# Altium schematic sheet IPMC_MACP.SchDoc: IPMC Driver
size A2; DrawnBy: YYH; Revision: 1.0; PageSetup: Record=PageOptions|CenterHorizontal=True|CenterVertical=True|PrintScale=0.52|XCorrection=1.00|YCorrection=1.00|PrintKind=0|BorderSize=5000000|LeftOffset=0|BottomOffset=0|Orientation=2|PaperLength=1000|PaperWidth=1000|Scale=100|PaperSource=7|PrintQuality=-3|MediaType=1|DitherType=10|PrintScaleMode=1|PaperKind=A4 210 x 297 毫米¦PaperIndex=9
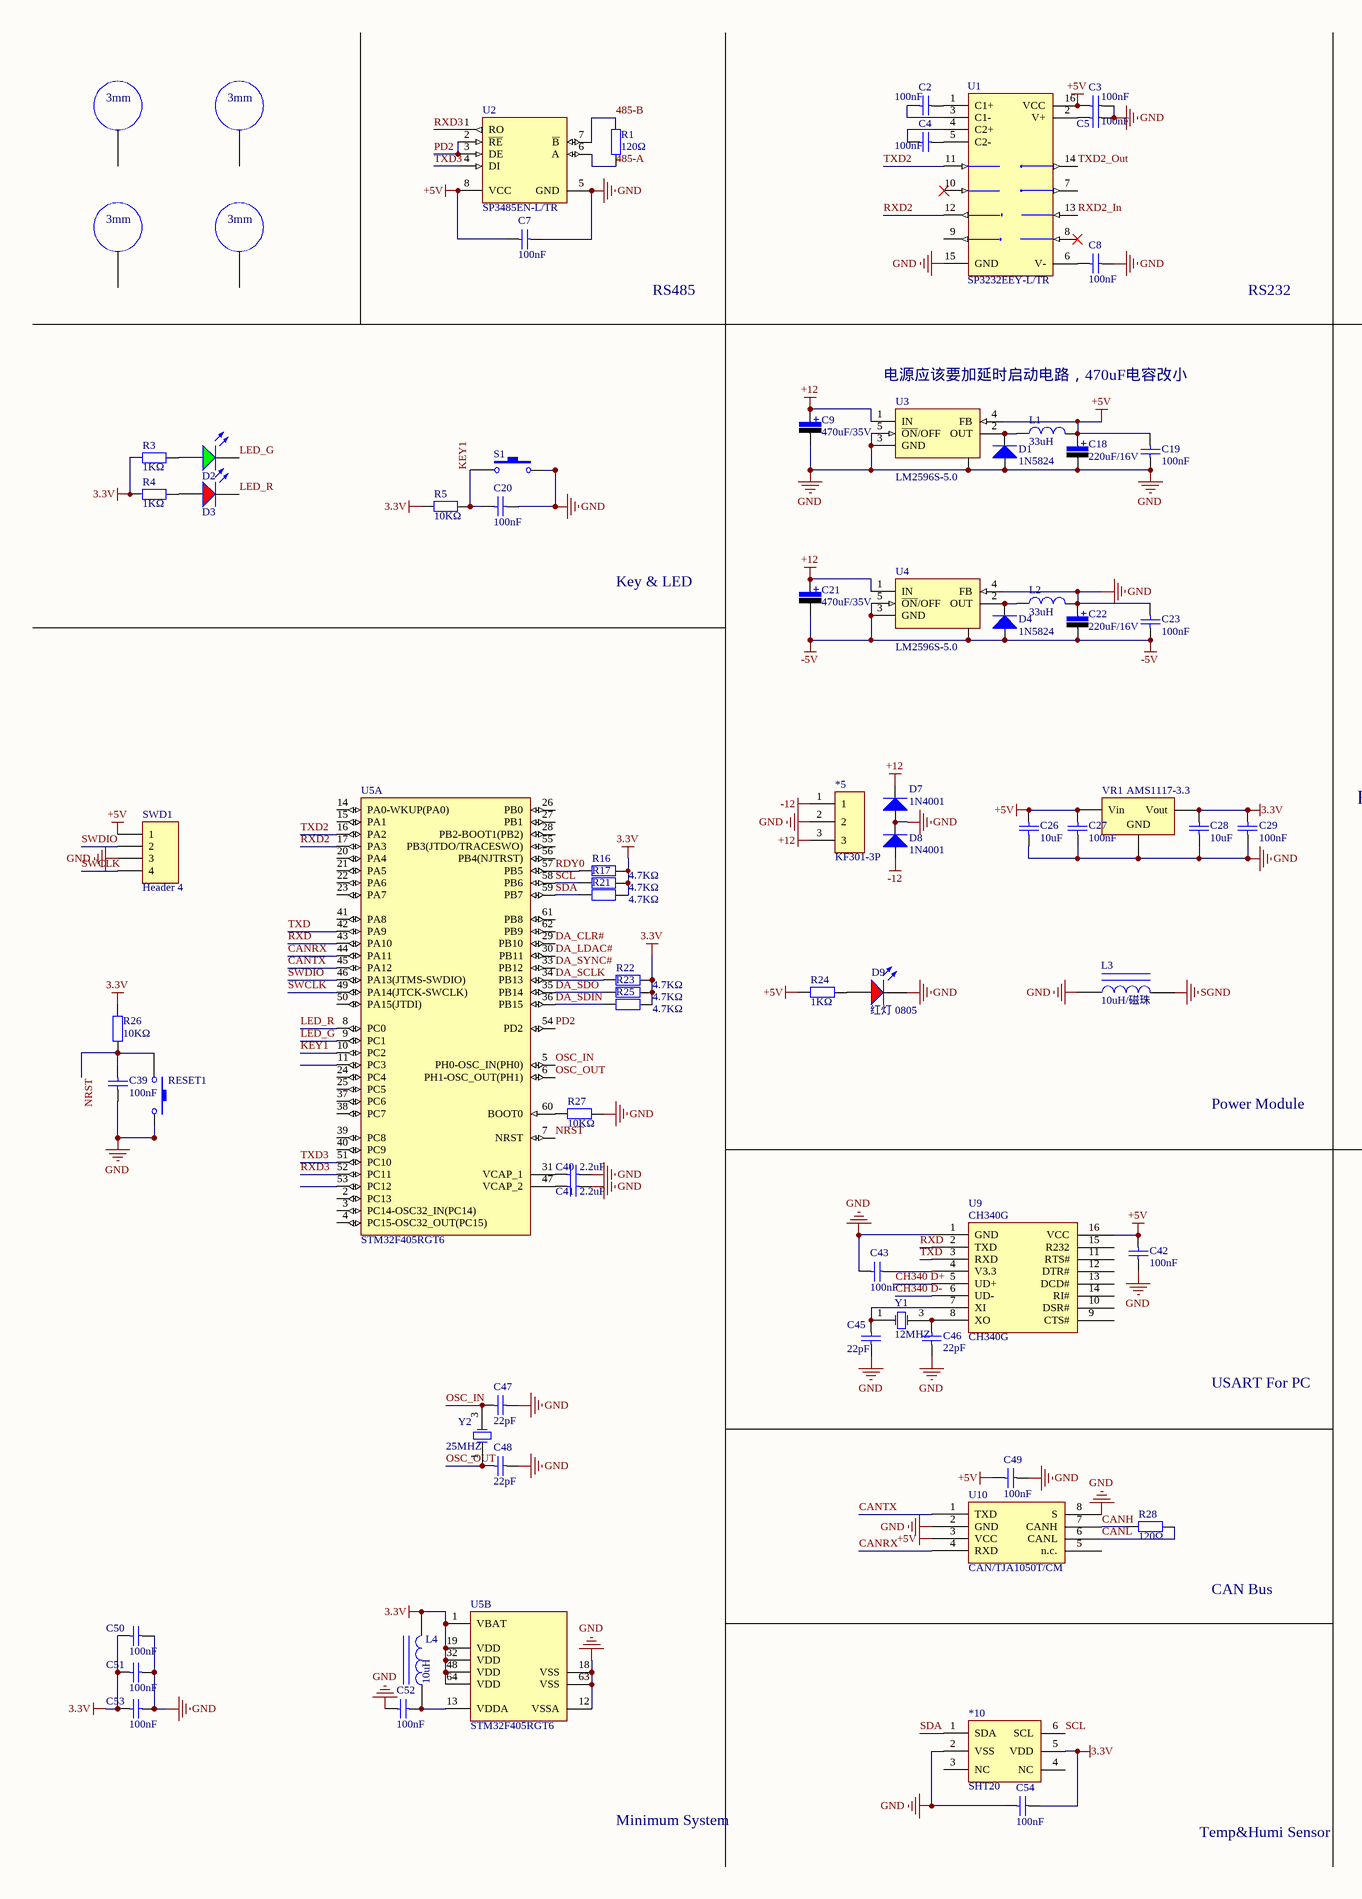
[diagram p0: IPMC_MACP.SchDoc, left]
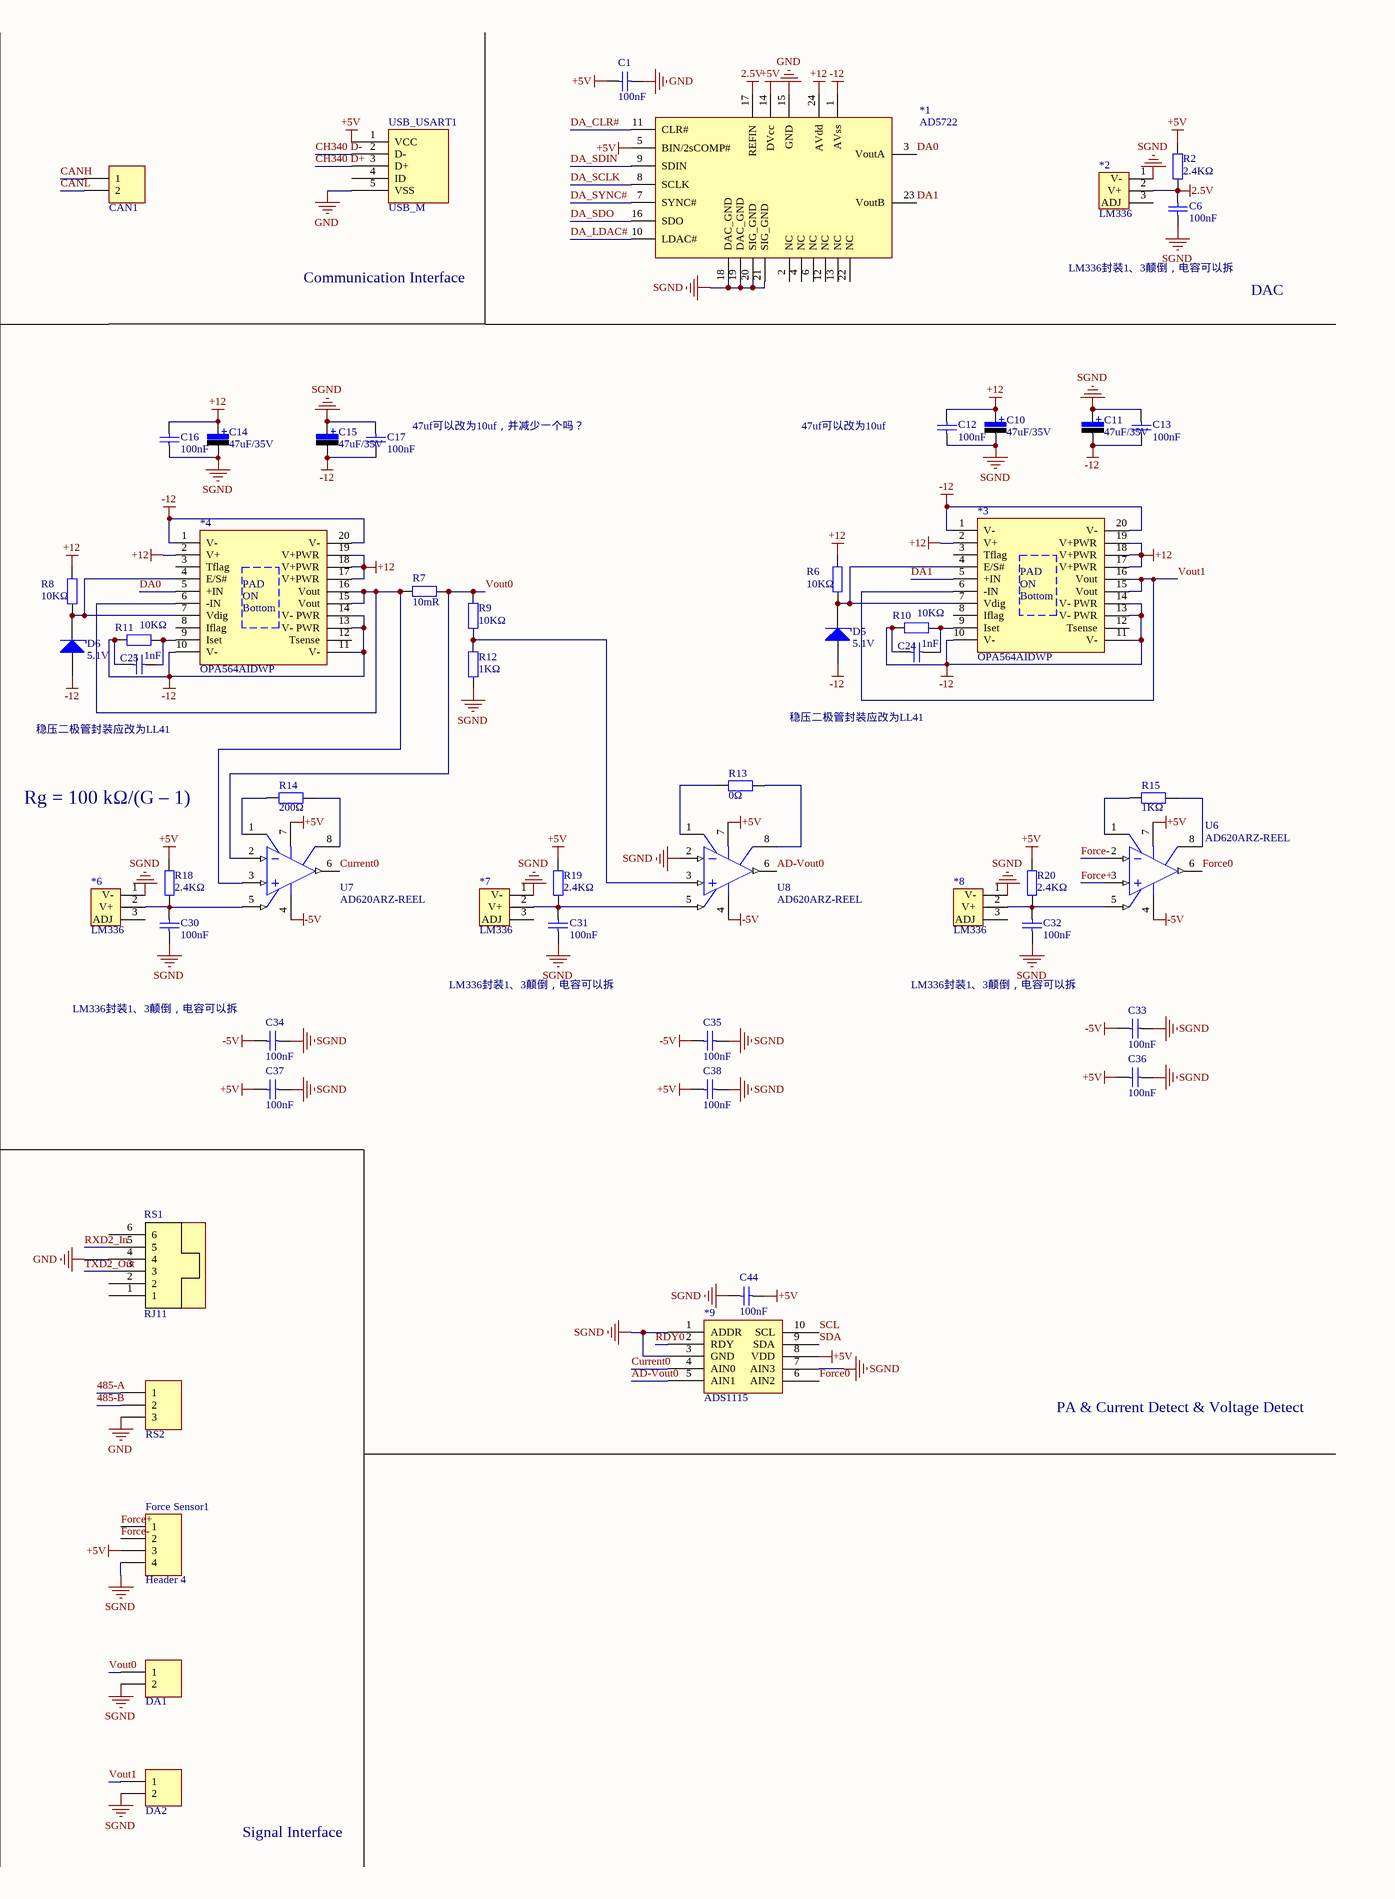
[diagram p1: IPMC_MACP.SchDoc, right]

## Parts
*1  AD5722  [TSSOP24P]
*2  LM336  [TO-92A]
*3  OPA564AIDWP  [HSOP20]
*4  OPA564AIDWP  [HSOP20]
*5  KF301-3P  [KF301-3P]
*6  LM336  [TO-92A]
*7  LM336  [TO-92A]
*8  LM336  [TO-92A]
*9  ADS1115  [MSOP-UN10_N]
*10  SHT20  [DFN6]
C1  100nF  [0805_C]
C2  100nF  [0805_C]
C3  100nF  [0805_C]
C4  100nF  [0805_C]
C5  100nF  [0805_C]
C6  100nF  [0805_C]
C7  100nF  [0805_C]
C8  100nF  [0805_C]
C9  470uF/35V  [C-RB-S10]
C10  47uF/35V  [C-RB-S6]
C11  47uF/35V  [C-RB-S6]
C12  100nF  [0805_C]
C13  100nF  [0805_C]
C14  47uF/35V  [C-RB-S6]
C15  47uF/35V  [C-RB-S6]
C16  100nF  [0805_C]
C17  100nF  [0805_C]
C18  220uF/16V  [C-RB-S6]
C19  100nF  [0805_C]
C20  100nF  [0805_C]
C21  470uF/35V  [C-RB-S10]
C22  220uF/16V  [C-RB-S6]
C23  100nF  [0805_C]
C24  1nF  [0805_C]
C25  1nF  [0805_C]
C26  10uF  [0805_C]
C27  100nF  [0805_C]
C28  10uF  [0805_C]
C29  100nF  [0805_C]
C30  100nF  [0805_C]
C31  100nF  [0805_C]
C32  100nF  [0805_C]
C33  100nF  [0805_C]
C34  100nF  [0805_C]
C35  100nF  [0805_C]
C36  100nF  [0805_C]
C37  100nF  [0805_C]
C38  100nF  [0805_C]
C39  100nF  [0805_C]
C40  2.2uF  [0805_C]
C41  2.2uF  [0805_C]
C42  100nF  [0805_C]
C43  100nF  [0805_C]
C44  100nF  [0805_C]
C45  22pF  [0805_C]
C46  22pF  [0805_C]
C47  22pF  [0805_C]
C48  22pF  [0805_C]
C49  100nF  [0805_C]
C50  100nF  [0805_C]
C51  100nF  [0805_C]
C52  100nF  [0805_C]
C53  100nF  [0805_C]
C54  100nF  [0805_C]
CAN1  Header 2  [HDR2X1_B1]  (value not drawn)
D1  1N5824  [DIODE-SMA]
D2  翠绿 0805  [0805_LED_S1]  (value not drawn)
D3  红灯 0805  [0805_LED_S1]  (value not drawn)
D4  1N5824  [DIODE-SMA]
D5  5.1V  [DIODE-1206]
D6  5.1V  [DIODE-1206]
D7  1N4001  [DIODE-SMA]
D8  1N4001  [DIODE-SMA]
D9  红灯 0805  [0805_LED_S1]
DA1  Header 2  [HDR2X1_B1]  (value not drawn)
DA2  Header 2  [HDR2X1_B1]  (value not drawn)
Force_Sensor1  Header 4  [HDR4X1_B1]
L1  33uH  [L-SMD-12]
L2  33uH  [L-SMD-12]
L3  10uH/磁珠  [0805_L]
L4  10uH  [0805_L]
R1  120Ω  [0805_R]
R2  2.4KΩ  [0805_R]
R3  1KΩ  [0805_R]
R4  1KΩ  [0805_R]
R5  10KΩ  [0805_R]
R6  10KΩ  [0805_R]
R7  10mR  [2512]
R8  10KΩ  [0805_R]
R9  10KΩ  [0805_R]
R10  10KΩ  [0805_R]
R11  10KΩ  [0805_R]
R12  1KΩ  [0805_R]
R13  0Ω  [0805_R]
R14  200Ω  [0805_R]
R15  1KΩ  [0805_R]
R16  4.7KΩ  [0805_R]
R17  4.7KΩ  [0805_R]
R18  2.4KΩ  [0805_R]
R19  2.4KΩ  [0805_R]
R20  2.4KΩ  [0805_R]
R21  4.7KΩ  [0805_R]
R22  4.7KΩ  [0805_R]
R23  4.7KΩ  [0805_R]
R24  1KΩ  [0805_R]
R25  4.7KΩ  [0805_R]
R26  10KΩ  [0805_R]
R27  10KΩ  [0805_R]
R28  120Ω  [0805_R]
RESET1  SW-PB  [SW_PB2_A1]  (value not drawn)
RS1  RJ11  [RJ6-RJ11]
RS2  Header 3  [HDR3X1_B1]  (value not drawn)
S1  SW-PB  [SW_PB2_A1]  (value not drawn)
SWD1  Header 4  [HDR1X4]
T1  M3铜柱螺丝孔  [螺丝孔-3mm]  (value not drawn)
T2  M3铜柱螺丝孔  [螺丝孔-3mm]  (value not drawn)
T3  M3铜柱螺丝孔  [螺丝孔-3mm]  (value not drawn)
T4  M3铜柱螺丝孔  [螺丝孔-3mm]  (value not drawn)
U1  SP3232EEY-L/TR  [TSSOP-16]
U2  SP3485EN-L/TR  [SOIC-8_150mil]
U3  LM2596S-5.0  [TO-263-5]
U4  LM2596S-5.0  [TO-263-5]
U5  STM32F405RGT6  [STM-LQFP64_L]  (parts A,B of 2)
U6  AD620ARZ-REEL  [SOIC-8_150mil]
U7  AD620ARZ-REEL  [SOIC-8_150mil]
U8  AD620ARZ-REEL  [SOIC-8_150mil]
U9  CH340G  [SOIC-16_150mil]
U10  CAN/TJA1050T/CM  [SOIC-8_150mil]
USB_USART1  USB_M  [USB_MICRO]
VR1  AMS1117-3.3  [SOT-223]
Y1  12MHZ  [SMD-3225_4P]
Y2  25MHZ  [SMD-3225_4P]

## Nets
2.5V: *1.17(REFIN) *2.2(V+) C6.2 R2.1
3.3V: *10.5(VDD) C28.2 C29.2 C50.1 C51.1 C53.1 C54.1 L4.2 R3.1 R4.1 R5.1 R16.2 R17.2 R21.2 R22.2 R23.2 R25.2 R26.1 U5.1(VBAT) U5.19(VDD) U5.32(VDD) U5.48(VDD) U5.64(VDD) VR1.2(Vout)
+5V: *1.5(BIN/2sCOMP#) *1.14(DVcc) *9.8(VDD) C1.2 C3.1 C7.2 C18.1 C19.2 C26.2 C27.2 C36.2 C37.2 C38.2 C42.2 C44.1 C49.2 Force_Sensor1.3 L1.2 R2.2 R18.2 R19.2 R20.2 R24.1 SWD1.1 U1.16(VCC) U2.8(VCC) U3.4(FB) U6.7(V+) U7.7(V+) U8.7(V+) U9.16(VCC) U10.3(VCC) USB_USART1.1(VCC) VR1.3(Vin)
+12: *1.24(AVdd) *3.2(V+) *3.17(V+PWR) *3.18(V+PWR) *3.19(V+PWR) *4.2(V+) *4.17(V+PWR) *4.18(V+PWR) *4.19(V+PWR) *5.3 C9.1 C10.1 C12.2 C14.1 C16.2 C21.1 D7.2(K) R6.2 R8.2 U3.1(IN) U4.1(IN)
-5V: C21.2 C22.2 C23.1 C33.2 C34.2 C35.2 D4.1(A) U4.3(GND) U4.5(~{ON}/OFF) U4.6 U6.4(V-) U7.4(V-) U8.4(V-)
-12: *1.1(AVss) *3.1(V-) *3.10(V-) *3.11(V-) *3.13(V-_PWR) *3.14(V-_PWR) *3.20(V-) *4.1(V-) *4.10(V-) *4.11(V-) *4.13(V-_PWR) *4.14(V-_PWR) *4.20(V-) *5.1 C11.2 C13.2 C15.2 C17.2 C24.1 C25.1 D5.1(A) D6.1(A) D8.1(A) R10.1 R11.1
GND: *1.15(GND) *5.2 *10.2(VSS) C1.1 C3.2 C5.2 C7.1 C8.2 C9.2 C18.2 C19.1 C20.2 C22.1 C23.2 C26.1 C27.1 C28.1 C29.1 C39.2 C40.2 C41.2 C42.1 C43.2 C45.1 C46.1 C47.1 C48.1 C49.1 C50.2 C51.2 C52.2 C53.2 C54.2 D1.1(A) D7.1(A) D8.2(K) D9.K L2.2 L3.1 R27.1 RESET1.2 RS1.4 RS2.3 S1.2 SWD1.3 U1.15(GND) U2.5(GND) U3.3(GND) U3.5(~{ON}/OFF) U3.6 U4.4(FB) U5.12(VSSA) U5.18(VSS) U5.63(VSS) U9.1(GND) U10.2(GND) U10.8(S) USB_USART1.5(VSS) VR1.1(GND)
SGND: *1.18(DAC_GND) *1.19(DAC_GND) *1.20(SIG_GND) *1.21(SIG_GND) *2.1(V-) *6.1(V-) *7.1(V-) *8.1(V-) *9.1(ADDR) *9.3(GND) *9.7(AIN3) C6.1 C10.2 C11.1 C12.1 C13.1 C14.2 C15.1 C16.1 C17.1 C30.1 C31.1 C32.1 C33.1 C34.1 C35.1 C36.1 C37.1 C38.1 C44.2 DA1.2 DA2.2 Force_Sensor1.4 L3.2 R12.2 U8.2(-IN)
485-A: R1.1 RS2.1 U2.6(A)
485-B: R1.2 RS2.2 U2.7(~{B})
AD-Vout0: *9.5(AIN1) U8.6(OUT)
CANH: CAN1.1 R28.1 U10.7(CANH)
CANL: CAN1.2 R28.2 U10.6(CANL)
CANRX: U5.44(PA11) U10.4(RXD)
CANTX: U5.45(PA12) U10.1(TXD)
CH340 D+: U9.5(UD+) USB_USART1.3(D+)
CH340 D-: U9.6(UD-) USB_USART1.2(D-)
Current0: *9.4(AIN0) U7.6(OUT)
DA0: *1.3(VoutA) *4.5(+IN)
DA1: *1.23(VoutB) *3.5(+IN)
DA_CLR#: *1.11(CLR#) U5.29(PB10)
DA_LDAC#: *1.10(LDAC#) U5.30(PB11)
DA_SCLK: *1.8(SCLK) R22.1 U5.34(PB13)
DA_SDIN: *1.9(SDIN) R25.1 U5.36(PB15)
DA_SDO: *1.16(SDO) R23.1 U5.35(PB14)
DA_SYNC#: *1.7(SYNC#) U5.33(PB12)
Force0: *9.6(AIN2) U6.6(OUT)
Force+: Force_Sensor1.1 U6.3(+IN)
Force-: Force_Sensor1.2 U6.2(-IN)
KEY1: C20.1 R5.2 S1.1 U5.10(PC2)
LED_G: D2.K U5.9(PC1)
LED_R: D3.K U5.8(PC0)
NRST: C39.1 R26.2 RESET1.1 U5.7(NRST)
OSC_IN: C47.2 U5.5(PH0-OSC_IN(PH0)) Y2.3(OSC2)
OSC_OUT: C48.2 U5.6(PH1-OSC_OUT(PH1)) Y2.1(OSC1)
PD2: U2.2(~{RE}) U2.3(DE) U5.54(PD2)
RDY0: *9.2(RDY) R16.1 U5.57(PB5)
RXD: U5.43(PA10) U9.2(TXD)
RXD2: U1.12(R1OUT) U5.17(PA3)
RXD2_In: RS1.5 U1.13(R1IN)
RXD3: U2.1(RO) U5.52(PC11)
SCL: *9.10(SCL) *10.6(SCL) R17.1 U5.58(PB6)
SDA: *9.9(SDA) *10.1(SDA) R21.1 U5.59(PB7)
SWCLK: SWD1.4 U5.49(PA14(JTCK-SWCLK))
SWDIO: SWD1.2 U5.46(PA13(JTMS-SWDIO))
TXD: U5.42(PA9) U9.3(RXD)
TXD2: U1.11(T1IN) U5.16(PA2)
TXD2_Out: RS1.3 U1.14(T1OUT)
TXD3: U2.4(DI) U5.51(PC10)
Vout0: DA1.1 R7.2 R9.1 U7.2(-IN)
Vout1: *3.6(-IN) *3.15(Vout) *3.16(Vout) DA2.1
Net*3_4: *3.4(E/S#) *3.7(Vdig) D5.2(K) R6.1
Net*3_9: *3.9(Iset) C24.2 R10.2
Net*4_4: *4.4(E/S#) *4.7(Vdig) D6.2(K) R8.1
Net*4_6: *4.6(-IN) *4.15(Vout) *4.16(Vout) R7.1 U7.3(+IN)
Net*4_9: *4.9(Iset) C25.2 R11.2
Net*6_2: *6.2(V+) C30.2 R18.1 U7.5(REF)
Net*7_2: *7.2(V+) C31.2 R19.1 U8.5(REF)
Net*8_2: *8.2(V+) C32.2 R20.1 U6.5(REF)
NetC2_1: C2.1 U1.3(C1-)
NetC2_2: C2.2 U1.1(C1+)
NetC4_1: C4.1 U1.4(C2+)
NetC4_2: C4.2 U1.5(C2-)
NetC5_1: C5.1 U1.2(V+)
NetC8_1: C8.1 U1.6(V-)
NetC40_1: C40.1 U5.31(VCAP_1)
NetC41_1: C41.1 U5.47(VCAP_2)
NetC43_1: C43.1 U9.4(V3.3)
NetC45_2: C45.2 U9.7(XI) Y1.1(OSC1)
NetC46_2: C46.2 U9.8(XO) Y1.3(OSC2)
NetC52_1: C52.1 L4.1 U5.13(VDDA)
NetD1_2: D1.2(K) L1.1 U3.2(OUT)
NetD2_A: D2.A R3.2
NetD3_A: D3.A R4.2
NetD4_2: D4.2(K) L2.1 U4.2(OUT)
NetD9_A: D9.A R24.2
NetR9_2: R9.2 R12.1 U8.3(+IN)
NetR13_1: R13.1 U8.1(RG)
NetR13_2: R13.2 U8.8(RG)
NetR14_1: R14.1 U7.1(RG)
NetR14_2: R14.2 U7.8(RG)
NetR15_1: R15.1 U6.1(RG)
NetR15_2: R15.2 U6.8(RG)
NetR27_2: R27.2 U5.60(BOOT0)

Not connected (* = marked no-connect by the designer): *1 2(NC) 4(NC) 6(NC) 12(NC) 13(NC) 22(NC); *2 3(ADJ); *3 3(Tflag) 8(Iflag) 12(Tsense); *4 3(Tflag) 8(Iflag) 12(Tsense); *6 3(ADJ); *7 3(ADJ); *8 3(ADJ); *10 3(NC) 4(NC); RS1 1 2 6; T1 1; T2 1; T3 1; T4 1; U1 7(T2OUT) 8(R2IN)* 9(R2OUT) 10(T2IN)*; U5 2(PC13) 3(PC14-OSC32_IN(PC14)) 4(PC15-OSC32_OUT(PC15)) 11(PC3) 14(PA0-WKUP(PA0)) 15(PA1) 20(PA4) 21(PA5) 22(PA6) 23(PA7) 24(PC4) 25(PC5) 26(PB0) 27(PB1) 28(PB2-BOOT1(PB2)) 37(PC6) 38(PC7) 39(PC8) 40(PC9) 41(PA8) 50(PA15(JTDI)) 53(PC12) 55(PB3(JTDO/TRACESWO)) 56(PB4(NJTRST)) 61(PB8) 62(PB9); U9 9(CTS#) 10(DSR#) 11(RTS#) 12(DTR#) 13(DCD#) 14(RI#) 15(R232); U10 5(n.c.); USB_USART1 4(ID)

## Notes on the sheet
- Communication Interface
- LM336封装1、3颠倒，电容可以拆
- RS485
- RS232
- DAC
- 电源应该要加延时启动电路，470uF电容改小
- (near C17) 47uf可以改为10uf，并减少一个吗？
- 47uf可以改为10uf
- Key & LED
- 稳压二极管封装应改为LL41
- Rg = 100 kΩ/(G – 1)
- Power Module
- USART For PC
- PA & Current Detect & Voltage Detect
- CAN Bus
- Minimum System
- Temp&Humi Sensor
- Signal Interface
- (in symbol M3铜柱螺丝孔) 3mm
- (in symbol OPA564AIDWP) PAD; ON; Bottom

## Library data of the parts
*1 = AD5722: 双极性DAC
*2 *6-*8 = LM336: 基准电压芯片2.5/5V
*3 *4 = OPA564AIDWP: PAD on Bottom
*5 = KF301-3P: 蓝色端子
C1-C8 C12 C13 C16 C17 C19 C20 C23 C27 C29-C39 C42-C44 C49-C54 = 0805 100nF(104) 10% 50V: 贴片电容; ComponentLink1Description: 供应商链接; ComponentLink1URL: http://www.szlcsc.com/product/details_50686.html; Package: 0805; Supplier: LC; SuppliersPartNumber: C49678
C9-C11 C14 C15 C18 C21 C22 = Cap Pol: 极性电解电容; Published: 8-Jun-2000; LatestRevisionDate: 17-Jul-2002; LatestRevisionNote: Re-released for DXP Platform.; PackageReference: RB7.6-15; Publisher: Altium Limited
C24 C25 = 0805 1nF (102) 10% 50V: 贴片电容; ComponentLink1Description: 供应商链接; ComponentLink1URL: http://www.szlcsc.com/product/details_52223.html; Package: 0805; Supplier: LC; SuppliersPartNumber: C51210
C26 C28 = 0805 10uF (106) 10% 25V: 贴片电容; ComponentLink1Description: 供应商链接; ComponentLink1URL: http://www.szlcsc.com/product/details_16532.html; Package: 0805; Supplier: LC; SuppliersPartNumber: C15850
C40 C41 = 0805 2.2uF (225) 20% 50V: 贴片电容; ComponentLink1Description: 供应商链接; ComponentLink1URL: http://www.szlcsc.com/product/details_50225.html; Package: 0805; Supplier: LC; SuppliersPartNumber: C49217
C45-C48 = 0805 22pF (220) 5% 50V: 贴片电容; ComponentLink1Description: 供应商链接; ComponentLink1URL: http://www.szlcsc.com/product/details_2156.html; Package: 0805; Supplier: LC; SuppliersPartNumber: C1804
CAN1 DA1 DA2 = Header 2: 接插件; LatestRevisionDate: 17-Jul-2002; LatestRevisionNote: Re-released for DXP Platform.; Publisher: Altium Limited
D1 D4 D7 D8 = Diode: 二极管; Published: 8-Jun-2000; LatestRevisionDate: 17-Jul-2002; LatestRevisionNote: Re-released for DXP Platform.; PackageDocument: Sep-1996; PackageReference: SMC; Publisher: Altium Limited; Code_JEDEC: DO-214-AB
D2 = 0805 翠绿: 发光二极管; ComponentLink1Description: 供应商链接; ComponentLink1URL: http://www.szlcsc.com/product/details_2670.html; Package: 0805; Supplier: LC; SuppliersPartNumber: C2297
D3 D9 = 0805 红灯: 发光二极管; ComponentLink1Description: 供应商链接; ComponentLink1URL: http://www.szlcsc.com/product/details_2668.html; Package: 0805; Supplier: LC; SuppliersPartNumber: C2295
D5 D6 = Diode-Z: 稳压二极管; Published: 8-Jun-2000; LatestRevisionDate: 17-Jul-2002; LatestRevisionNote: Re-released for DXP Platform.; PackageReference: SMB; Publisher: Altium Limited; Code_JEDEC: DO-214-AA
Force_Sensor1 SWD1 = Header 4: Header, 4-Pin; LatestRevisionDate: 17-Jul-2002; LatestRevisionNote: Re-released for DXP Platform.; Publisher: Altium Limited
L1 L2 = Inductor: 电感; Code_IEC: 1005; Published: 8-Jun-2000; LatestRevisionDate: 17-Jul-2002; LatestRevisionNote: Re-released for DXP Platform.; PackageReference: 0402-A; Publisher: Altium Limited; Code_JEITA: 0402
L3 L4 = 0805 10uH 10%: 贴片电感; ComponentLink1Description: 供应商链接; ComponentLink1URL: http://www.szlcsc.com/product/details_1398.html; Package: 0805; Supplier: LC; SuppliersPartNumber: C1046
R1 R28 = 0805 120Ω (1200) 1%: 贴片电阻; ComponentLink1Description: 供应商链接; ComponentLink1URL: http://www.szlcsc.com/product/details_18125.html; Package: 0805; Supplier: LC; SuppliersPartNumber: C17437
R2 R18-R20 = 0805 2.4KΩ (2401) 1%: 贴片电阻; ComponentLink1Description: 供应商链接; ComponentLink1URL: http://www.szlcsc.com/product/details_18214.html; Package: 0805; Supplier: LC; SuppliersPartNumber: C17526
R3 R4 R15 R24 = 0805 1KΩ (1001) 1%: 贴片电阻; ComponentLink1Description: 供应商链接; ComponentLink1URL: http://www.szlcsc.com/product/details_18201.html; Package: 0805; Supplier: LC; SuppliersPartNumber: C17513
R5 R6 R8 R10 R11 R26 R27 = 0805 10KΩ (1002) 1%: 贴片电阻; ComponentLink1Description: 供应商链接; ComponentLink1URL: http://www.szlcsc.com/product/details_18102.html; Package: 0805; Supplier: LC; SuppliersPartNumber: C17414
R7 = Res1: 贴片电阻; Published: 8-Jun-2000; LatestRevisionDate: 17-Jul-2002; LatestRevisionNote: Re-released for DXP Platform.; PackageReference: AXIAL-0.4; Publisher: Altium Limited
R9 R12 = 0805 20KΩ (2002) 1%: 贴片电阻; ComponentLink1Description: 供应商链接; ComponentLink1URL: http://www.szlcsc.com/product/details_4735.html; Package: 0805; Supplier: LC; SuppliersPartNumber: C4328
R13 = 0805 0Ω (0R0) 1%: 贴片电阻; ComponentLink1Description: 供应商链接; ComponentLink1URL: http://www.szlcsc.com/product/details_18165.html; Package: 0805; Supplier: LC; SuppliersPartNumber: C17477
R14 = 0805 200Ω (2000) 1%: 贴片电阻; ComponentLink1Description: 供应商链接; ComponentLink1URL: http://www.szlcsc.com/product/details_18228.html; Package: 0805; Supplier: LC; SuppliersPartNumber: C17540
R16 R17 R21-R23 R25 = 0805 4.7KΩ (4701) 1%: 贴片电阻; ComponentLink1Description: 供应商链接; ComponentLink1URL: http://www.szlcsc.com/product/details_18361.html; Package: 0805; Supplier: LC; SuppliersPartNumber: C17673
RESET1 S1 = SW-PB: 微动开关; Published: 24-Mar-1999; LatestRevisionDate: 17-Jul-2002; LatestRevisionNote: Re-released for DXP Platform.; PackageReference: SPST-2; Publisher: Altium Limited
RS2 = Header 3: 接插件; LatestRevisionDate: 17-Jul-2002; LatestRevisionNote: Re-released for DXP Platform.; Publisher: Altium Limited
U1 = SP3232EEY-L/TR: RS232; ComponentLink1Description: 供应商链接; ComponentLink1URL: http://www.szlcsc.com/product/details_14131.html; Package: TSSOP-16; Supplier: LC; SuppliersPartNumber: C13482
U2 = SP3485EN-L/TR: RS-485/RS-422; ComponentLink1Description: 供应商链接; ComponentLink1URL: http://www.szlcsc.com/product/details_9482.html; Package: SOIC-8; Supplier: LC; SuppliersPartNumber: C8963
U3 U4 = LM2596S-5.0: 5V稳压芯片; Note: Tab is connected to GND; Published: 15-Apr-2002; DatasheetVersion: Dec-1997; PackageReference: TS5B; Publisher: Altium Limited; PackageDescription: D2-PAK; 5 Leads; Body 14.4 (inc. leads) x 10.4 mm (LxW max); ComponentLink1Description: Manufacturer Link; ComponentLink1URL: http://www.national.com/; ComponentLink2Description: Datasheet; ComponentLink2URL: http://www.national.com/ds.cgi/LM/LM2596.pdf; ComponentLink3Description: URL Link1; ComponentLink3URL: http://www.national.com/pf/LM/LM2596.html
U5 = STM32F405RGT6: ARM Cortex-M4 32-bit MCU+FPU, 210 DMIPS, 1024 kB Flash, 192 kB Internal RAM, 51 I/Os, 64-pin LQFP, -40 to 85 degC, Tray; Manufacturer: STMicroelectronics; D/A Converter: 2x12-bit; FLASH Size (Prog) (kB): 1024; I/Os (High Current): 51; Internal RAM Size (kB): 192; Operating Frequency(F) (Processor speed) (MHz): 168; Supply Voltage(Vcc) max (V): 3.6; Supply Voltage(Vcc) min (V): 1.8; DatasheetVersion: Rev. 4; PackageVersion: Rev. 4, 06/2013; PackageReference: LQFP64; PackageDescription: 64-Pin Low Profile Quad Flat Package, 10 x 10 mm Body, 0.5 mm Pitch; Supplier 1: Digi-Key; Supplier Part Number 1: 497-11767-ND; Supplier 2: Farnell; Supplier Part Number 2: 2064363; Supplier 3: Newark; Supplier Part Number 3: 73T2329; Supplier 4: Mouser; Supplier Part Number 4: 511-STM32F405RGT6; Core: ARM Cortex-M4; Packing: Tray; Mounting Technology: Surface Mount; PartNumber: STM32F405RGT6; ComponentLink1Description: Manufacturer URL; ComponentLink1URL: http://www.st.com/web/en/home.html; ComponentLink2Description: Datasheet; ComponentLink2URL: http://www.st.com/st-web-ui/static/active/en/resource/technical/document/datasheet/DM00037051.pdf; ComponentLink3Description: Package Specification; ComponentLink3URL: http://www.st.com/st-web-ui/static/active/en/resource/technical/document/datasheet/DM00037051.pdf
U6-U8 = AD620ARZ-REEL: 仪放; ComponentLink1Description: 供应商链接; ComponentLink1URL: http://www.szlcsc.com/product/details_10205.html; Package: SOIC-8_150mil; Supplier: LC; SuppliersPartNumber: C9675
U9 = CH340G: USB; ComponentLink1Description: 供应商链接; ComponentLink1URL: http://www.szlcsc.com/product/details_14927.html; Package: SOIC-16_150mil; Supplier: LC; SuppliersPartNumber: C14267
U10 = CAN/TJA1050T/CM: CAN; ComponentLink1Description: 供应商链接; ComponentLink1URL: http://www.szlcsc.com/product/details_7424.html; Package: SOIC-8_150mil; Supplier: LC; SuppliersPartNumber: C6952
USB_USART1 = USB_M: MicroUSB接口
VR1 = SOT-223 AMS1117-3.3: 低压差线性稳压(LDO); ComponentLink1Description: 供应商链接; ComponentLink1URL: http://www.szlcsc.com/product/details_6652.html; Package: SOT-223; Supplier: LC; SuppliersPartNumber: C6186
Y1 = SMD-3225_4P  12MHZ 20PF 10PPM: 贴片晶振; ComponentLink1Description: 供应商链接; ComponentLink1URL: http://www.szlcsc.com/product/details_9522.html; Package: SMD-3225_4P; Supplier: LC; SuppliersPartNumber: C9002
Y2 = SMD-3225_4P  25MHZ 12PF 10PPM: 贴片晶振; ComponentLink1Description: 供应商链接; ComponentLink1URL: http://www.szlcsc.com/product/details_9526.html; Package: SMD-3225_4P; Supplier: LC; SuppliersPartNumber: C9006